# Altium schematic sheet schematics.SchDoc
size A4
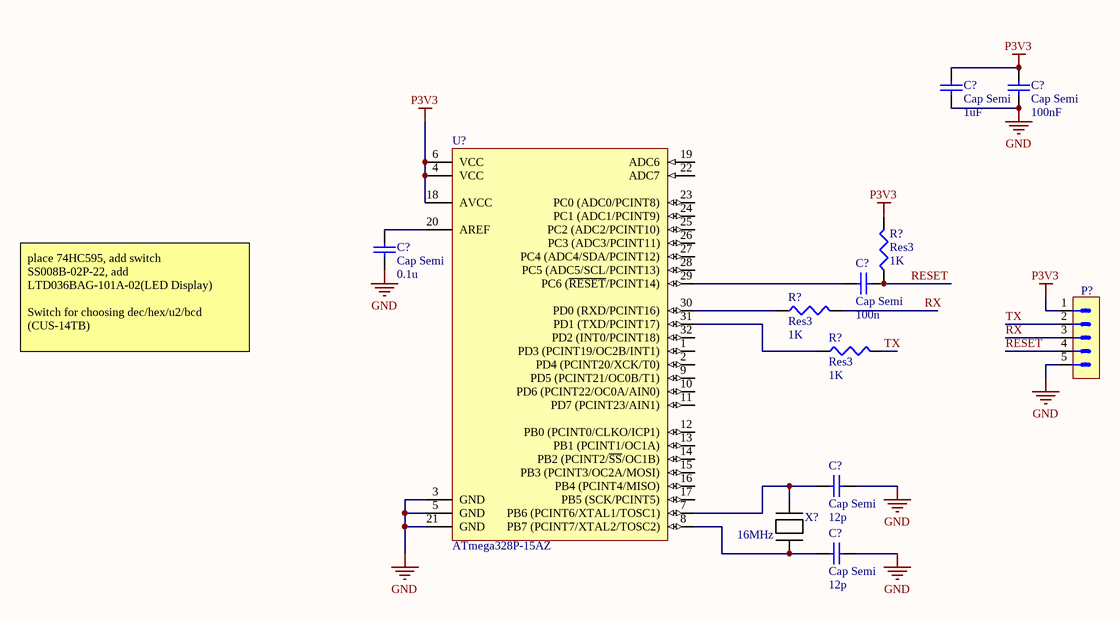
[diagram p0: schematics.SchDoc]

## Parts
(Parts that share a designator on the sheet are numbered #1, #2 ... from top to bottom, then left to right.)
C?#1  Cap Semi  value 100nF  [C1206]
C?#2  Cap Semi  value 1uF  [1608[0603]]
C?#3  Cap Semi  value 0.1u  [1608[0603]]
C?#4  Cap Semi  value 100n  [1608[0603]]
C?#5  Cap Semi  value 12p  [1608[0603]]
C?#6  Cap Semi  value 12p  [1608[0603]]
P?  SSW-105-02-G-S  [SAMTEC_SSW-105-02-G-S]  (value not drawn)
R?#1  Res3  value 1K  [J1-0603]
R?#2  Res3  value 1K  [J1-0603]
R?#3  Res3  value 1K  [J1-0603]
U?  ATmega328P-15AZ  [32MA_M]
X?  16MHz  [MIC]

## Nets
GND: C?#1.2 C?#2.1 C?#3.1 C?#5.1 C?#6.1 P?.5 U?.3(GND) U?.5(GND) U?.21(GND)
P3V3: C?#1.1 C?#2.2 P?.1 R?#1.2 U?.4(VCC) U?.6(VCC) U?.18(AVCC)
RESET: C?#4.1 P?.4 R?#1.1
RX: P?.3 R?#2.2
TX: P?.2 R?#3.2
NetC?#3_2: C?#3.2 U?.20(AREF)
NetC?#4_2: C?#4.2 U?.29(PC6_(~{RESET}/PCINT14))
NetC?#5_2: C?#5.2 U?.7(PB6_(PCINT6/XTAL1/TOSC1)) X?.1
NetC?#6_2: C?#6.2 U?.8(PB7_(PCINT7/XTAL2/TOSC2)) X?.2
NetR?#2_1: R?#2.1 U?.30(PD0_(RXD/PCINT16))
NetR?#3_1: R?#3.1 U?.31(PD1_(TXD/PCINT17))

Not connected (* = marked no-connect by the designer): U? 1(PD3_(PCINT19/OC2B/INT1)) 2(PD4_(PCINT20/XCK/T0)) 9(PD5_(PCINT21/OC0B/T1)) 10(PD6_(PCINT22/OC0A/AIN0)) 11(PD7_(PCINT23/AIN1)) 12(PB0_(PCINT0/CLKO/ICP1)) 13(PB1_(PCINT1/OC1A)) 14(PB2_(PCINT2/~{SS}/OC1B)) 15(PB3_(PCINT3/OC2A/MOSI)) 16(PB4_(PCINT4/MISO)) 17(PB5_(SCK/PCINT5)) 19(ADC6) 22(ADC7) 23(PC0_(ADC0/PCINT8)) 24(PC1_(ADC1/PCINT9)) 25(PC2_(ADC2/PCINT10)) 26(PC3_(ADC3/PCINT11)) 27(PC4_(ADC4/SDA/PCINT12)) 28(PC5_(ADC5/SCL/PCINT13)) 32(PD2_(INT0/PCINT18))

## Notes on the sheet
- place 74HC595, add switch SS008B-02P-22, add LTD036BAG-101A-02(LED Display)
  Switch for choosing dec/hex/u2/bcd (CUS-14TB)
  Switch for power on/off OS102011MA1QN1

## Library data of the parts
C?#1-C?#6 = Cap Semi: Capacitor (Semiconductor SIM Model); Published: 8-Jun-2000; LatestRevisionDate: 29-May-2009; LatestRevisionNote: IPC-7351 Footprint Added.; PackageReference: C1206; Publisher: Altium Limited; PackageDescription: Chip Capacitor
P? = HDR_THT_5X1V_F_2P54MM: General Purpose Header: THT, 2.54mm, Female, Straight, Long Lead; Manufacturer: GENERIC; Manufacturer 1 Example: Samtec; Manufacturer 1 Component Height: 11.55mm; Current Max: 3A; PressFit: No; DesignItemId: HDR_THT_5X1V_F_2P54MM; Author: UN; Family: SSW; Component Kind: Standard; Footprint: HDR_5X1V_F_2P54MM; HelpURL: https://pl.mouser.com/datasheet/2/527/ssw_th-1507658.pdf; Manufacturer Part Number: HDR_THT_5X1V_F_2P54MM; Manufacturer 1 Part Number: SSW-105-02-G-S; Mounted: Yes; Part Description: General Purpose Header: THT, 2.54mm, Female, Straight, Long Lead; Pin Count: 5; Sense: No; SMD: No; Socket: No; Status: Recommended; Supplier 1: TME; Supplier 2: Mouser; Create Date: 19.08.2014; LatestRevisionDate: 19.08.2014; Supplier Part Number 1: ZL262-5SG
R?#1-R?#3 = Res3: Resistor; Published: 8-Jun-2000; LatestRevisionDate: 29-May-2009; LatestRevisionNote: IPC-7351 Footprint Added.; PackageReference: J1-0603; Publisher: Altium Limited; PackageDescription: Chip Resistor
U? = CMP-0096-00111-2: 8-bit Automotive AVR Microcontroller, 32KB Flash, 1KB EEPROM, 2KB SRAM, 23 GPIO pins, Automotive Grade (-40°C to +125°C), 32-Pin TQFP; ComponentLink2URL: http://www.atmel.com/dyn/resources/prod_documents/doc7810.pdf; PackageDescription: 32-Lead Thin Profile Plastic Quad Flatpack (TQFP) - 7x7x1mm Body,  0.8 mm Pitch; PackageVersion: revB, Jul-2007; ComponentLink2Description: ATmega328P Datasheet; ComponentLink1Description: Manufacturer URL; DatasheetVersion: revA, Nov-2009; RevisionNote: URLs added; ComponentLink1URL: http://www.atmel.com/; PackageReference: 32MA
X? = KWARC